# Altium schematic sheet Supply.SchDoc: =VariantName
size 274 x 177 mm; SheetNumber: 7; SheetTotal: 7
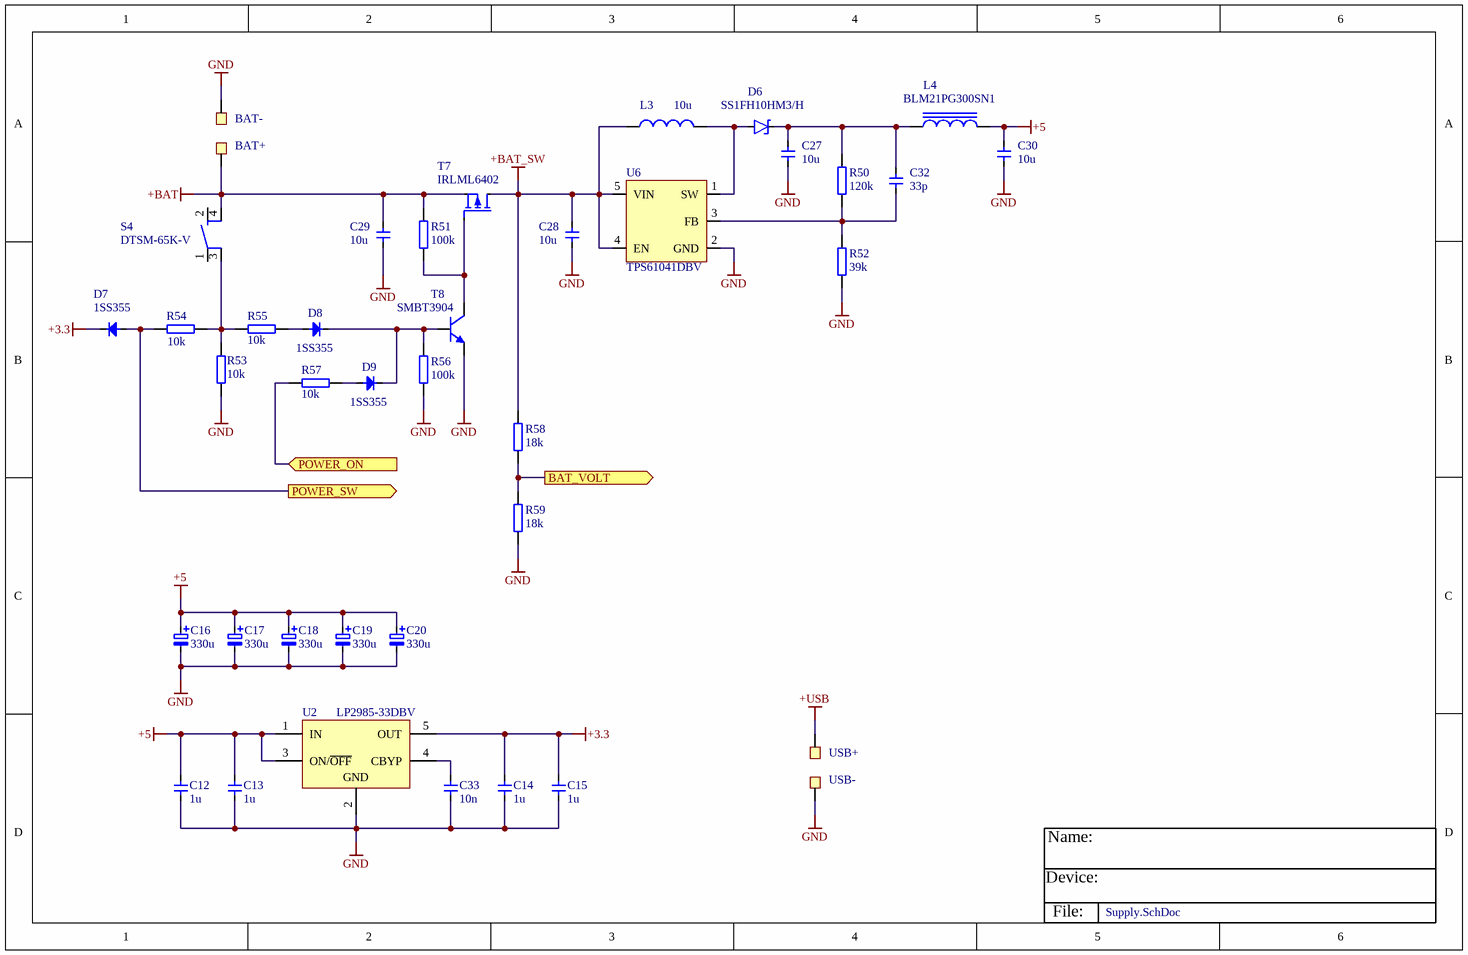
[diagram p0: Supply.SchDoc]

## Parts
BAT+  PAD  [PAD_SMD_2x4]  (value not drawn)  (no BOM)
BAT-  PAD  [PAD_SMD_2x4]  (value not drawn)  (no BOM)
C12  1u  [C0805]
C13  1u  [C0805]
C14  1u  [C0805]
C15  1u  [C0805]
C16  330u  [D]
C17  330u  [D]
C18  330u  [D]
C19  330u  [D]
C20  330u  [D]
C27  10u  [C0805]
C28  10u  [C0805]
C29  10u  [C0805]
C30  10u  [C0805]
C32  33p  [C0805]
C33  10n  [C0805]
D6  SS1FH10HM3/H  [DO-219AB]
D7  1SS355  [SOD323]
D8  1SS355  [SOD323]
D9  1SS355  [SOD323]
L3  10u  [L1008]
L4  BLM21PG300SN1  [L0805]
R50  120k  [R0805]
R51  100k  [R0805]
R52  39k  [R0805]
R53  10k  [R0805]
R54  10k  [R0805]
R55  10k  [R0805]
R56  100k  [R0805]
R57  10k  [R0805]
R58  18k  [R0805]
R59  18k  [R0805]
S4  DTSM-65K-V  [DTSM-65K-V]
T7  IRLML6402  [MICRO3]
T8  SMBT3904  [SOT23J]
U2  LP2985-33DBV  [DBV_R-PDSO-G5]
U6  TPS61041DBV  [DBV_R-PDSO-G5]
USB+  PAD  [PAD_SMD_2x4]  (value not drawn)  (no BOM)
USB-  PAD  [PAD_SMD_2x4]  (value not drawn)  (no BOM)

## Ports
BAT_VOLT (out), POWER_ON (in), POWER_SW (out)

## Nets
+3.3: C14.2 C15.2 D7.K U2.5(OUT)
+5: C12.2 C13.2 C16.+ C17.+ C18.+ C19.+ C20.+ C30.2 L4.2 U2.1(IN) U2.3(ON/~{OFF})
+BAT: BAT+.1 C29.2 R51.1 S4.4 T7.S
+BAT_SW: C28.2 L3.1 R58.1 T7.D U6.4(EN) U6.5(VIN)
+USB: USB+.1
GND: BAT-.1 C12.1 C13.1 C14.1 C15.1 C16.- C17.- C18.- C19.- C20.- C27.1 C28.1 C29.1 C30.1 C33.1 R52.2 R53.1 R56.2 R59.2 T8.1(E) U2.2(GND) U6.2(GND) USB-.1
BAT_VOLT: R58.2 R59.1 ; port BAT_VOLT
POWER_ON: R57.1 ; port POWER_ON
POWER_SW: D7.A R54.1 ; port POWER_SW
NetC27_2: C27.2 C32.2 D6.K L4.1 R50.1
NetC32_1: C32.1 R50.2 R52.1 U6.3(FB)
NetC33_2: C33.2 U2.4(CBYP)
NetD6_A: D6.A L3.2 U6.1(SW)
NetD8_A: D8.A R55.2
NetD8_K: D8.K D9.K R56.1 T8.2(B)
NetD9_A: D9.A R57.2
NetR51_2: R51.2 T7.G T8.3(C)
NetR53_2: R53.2 R54.2 R55.1 S4.3(P2)

Not connected (* = marked no-connect by the designer): S4 1(P1) 2(S1)

## Notes on the sheet
- Name:
- Device:
- File:

## Library data of the parts
BAT+ BAT- USB+ USB- = CON1: CON;; P&P: 0; Value: PAD
C12-C15 C27-C30 C32 C33 = c: C; capacitor; Indeks: MKOS0603021; P&P: 1
  C12-C15: Value: 1u
  C27-C30: Value: 10u
  C32: Value: 33p
  C33: Value: 10n
C16-C20 = C_pol: C; Polarized Capacitor; Value: 330u
D6 = SS1FH10HM3/H: DS; Schottky Power Rectifier 1A 100V; Indeks: MDISS139; Nap robocze: 100V 1A; Obudowa: SMF; P&P: 1; Value: SS1FH10HM3/H
D7-D9 = 1SS355: D; Diode general; Indeks: MDISL001; P&P: 1; Value: 1SS355
L3 = L: L;; Indeks: MIDSD252; P&P: 1; Value: 10u
L4 = BLM21PG300SN1: L;; Indeks: MIDSD062; P&P: 1; Value: BLM21PG300SN1
R50-R59 = R: R; resistor; Indeks: *; P&P: *
  R50: Value: 120k
  R51 R56: Value: 100k
  R52: Value: 39k
  R53-R55 R57: Value: 10k
  R58 R59: Value: 18k
S4 = DTSM-65K-V: SWITCH; TACT switch, 6x6, h=9.5mm; Indeks: MPLSM008; P&P: 1; Value: DTSM-65K-V
T7 = IRLML6402: T_M_P; P-Channel MOSFET; Indeks: MTRSP030; P&P: 1; Value: IRLML6402
T8 = SMBT3904: T_NPN; Bipolar Transistor; Indeks: MTRSB002; P&P: 1; Value: SMBT3904
U2 = LP2985-33DBV: LDO; Micropower 150 mA Low-Noise Ultra Low-Dropout Regulator in  SOT-23 and micro SMD Packages; PartNumber: LP2985AIM5-3.3; Manufacturer: National Semiconductor; CompType: LDO IC; PackageTopMarking: L0RA*XTT; PowerWise: N; Indeks: MUKSC203; P&P: 1; Published: 4-Dec-2008; DatasheetVersion: Jul-2007; PackageVersion: revD, Aug-2008; PackageReference: MF05A; Publisher: Altium Limited; PackageDescription: Molded SOT-23, .115 x .063 x .040 in Body, 5 Lead, .0375 in Pitch; RoHS: O; PinCount: 5; DigiKeyPartNumber: LP2985AIM5-3.3CT-ND; ComponentLink1Description: LP2985 Datasheet; ComponentLink1URL: http://www.national.com/ds/LP/LP2985.pdf; ComponentLink2Description: LP2985 Web Page; ComponentLink2URL: http://www.national.com/pf/LP/LP2985.html; ComponentLink3Description: MF05A Package Page; ComponentLink3URL: http://www.national.com/packaging/folders/mf05a.html; Value: LP2985-33DBV
U6 = TPS61041DBV: DC/DC; 28V, 250mA Switch Boost Converter for LCD and White LED Applications; Indeks: MUKSC162; P&P: 1; Value: TPS61041DBV